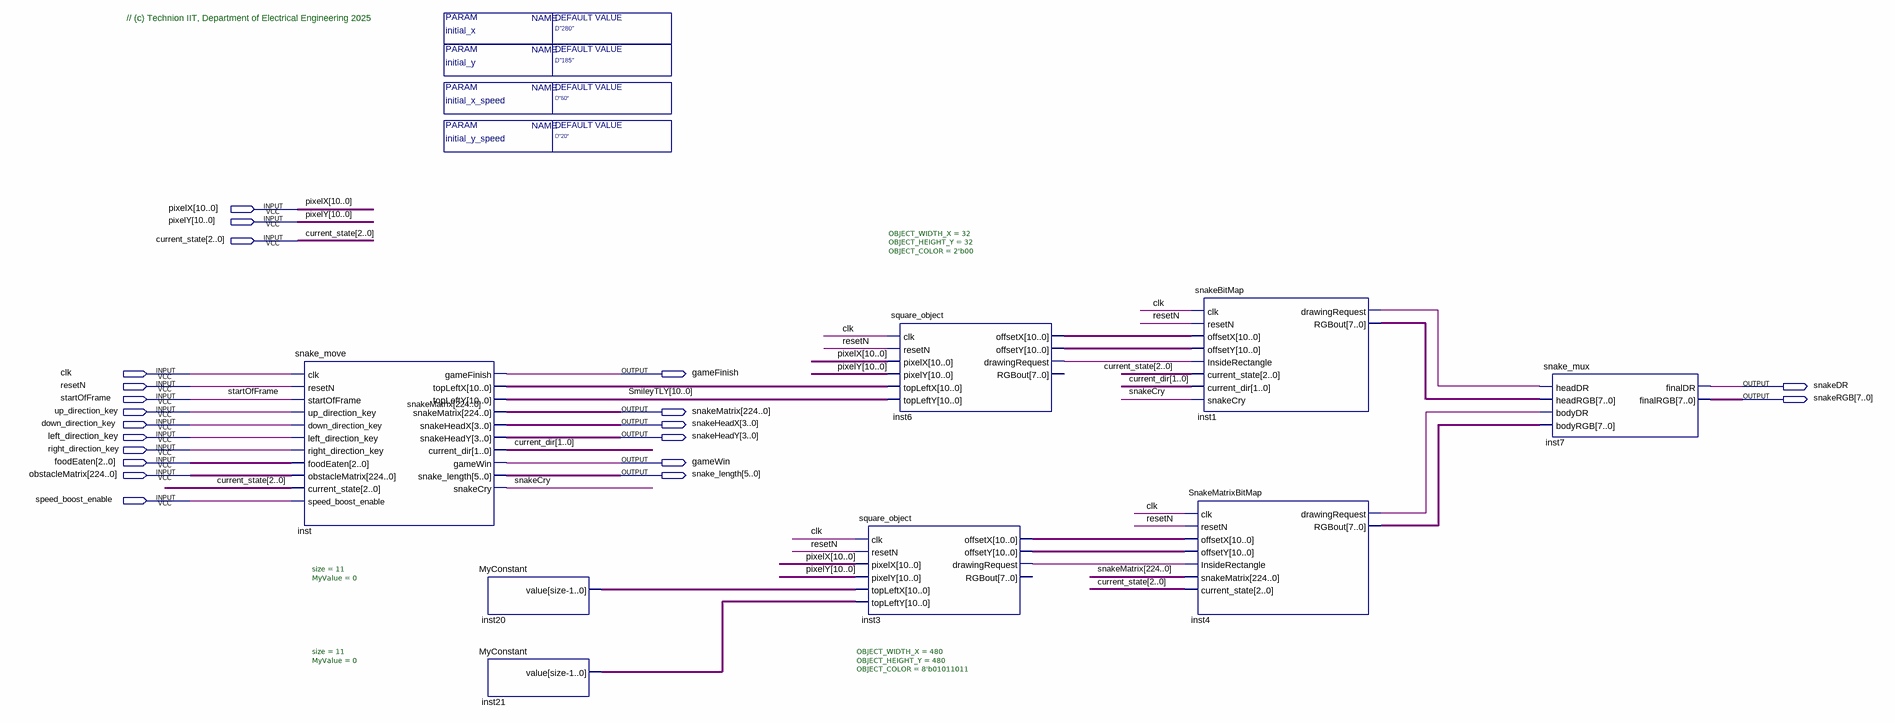
[diagram p0: schematic sheet]
// Quartus schematic Snake_Block.bdf as structural Verilog: 8 symbols, 21 pins
module Snake_Block #(parameter initial_x = "D\"280\"", parameter initial_y = "D\"185\"", parameter initial_x_speed = "D\"60\"", parameter initial_y_speed = "D\"20\"") (
  input  [10:0] pixelX,
  input  [10:0] pixelY,
  input  [2:0] current_state,
  input  clk,
  input  resetN,
  input  startOfFrame,
  input  up_direction_key,
  input  down_direction_key,
  input  left_direction_key,
  input  right_direction_key,
  input  [2:0] foodEaten,
  input  [224:0] obstacleMatrix,
  input  speed_boost_enable,
  output gameFinish,
  output snakeDR,
  output [7:0] snakeRGB,
  output [224:0] snakeMatrix,
  output [3:0] snakeHeadX,
  output [3:0] snakeHeadY,
  output gameWin,
  output [5:0] snake_length
);

  wire inst1_drawingrequest, inst3_drawingrequest, inst4_drawingrequest, inst6_drawingrequest, snakeCry;
  wire [1:0] current_dir;
  wire [7:0] inst1_rgbout, inst4_rgbout;
  wire [10:0] inst3_offsetx, inst3_offsety, inst6_offsetx, inst6_offsety, inst20_value, inst21_value,
       inst_topleftx, SmileyTLY;

  snake_move inst (
    .clk(clk), .resetN(resetN), .startOfFrame(startOfFrame), .up_direction_key(up_direction_key),
    .down_direction_key(down_direction_key), .left_direction_key(left_direction_key),
    .right_direction_key(right_direction_key), .foodEaten(foodEaten), .obstacleMatrix(obstacleMatrix),
    .current_state(current_state), .speed_boost_enable(speed_boost_enable), .gameFinish(gameFinish),
    .topLeftX(inst_topleftx), .topLeftY(SmileyTLY), .snakeMatrix(snakeMatrix), .snakeHeadX(snakeHeadX),
    .snakeHeadY(snakeHeadY), .current_dir(current_dir), .gameWin(gameWin), .snake_length(snake_length),
    .snakeCry(snakeCry));
  MyConstant #(.size(11), .MyValue(0)) inst20 (.value(inst20_value));
  MyConstant #(.size(11), .MyValue(0)) inst21 (.value(inst21_value));
  square_object #(.OBJECT_WIDTH_X(32), .OBJECT_HEIGHT_Y(32), .OBJECT_COLOR(2'b00)) inst6 (
    .clk(clk), .resetN(resetN), .pixelX(pixelX), .pixelY(pixelY), .topLeftX(inst_topleftx),
    .topLeftY(SmileyTLY), .offsetX(inst6_offsetx), .offsetY(inst6_offsety),
    .drawingRequest(inst6_drawingrequest));  // open: RGBout
  square_object #(.OBJECT_WIDTH_X(480), .OBJECT_HEIGHT_Y(480), .OBJECT_COLOR(8'b01011011)) inst3 (
    .clk(clk), .resetN(resetN), .pixelX(pixelX), .pixelY(pixelY), .topLeftX(inst20_value),
    .topLeftY(inst21_value), .offsetX(inst3_offsetx), .offsetY(inst3_offsety),
    .drawingRequest(inst3_drawingrequest));  // open: RGBout
  snakeBitMap inst1 (
    .clk(clk), .resetN(resetN), .offsetX(inst6_offsetx), .offsetY(inst6_offsety),
    .InsideRectangle(inst6_drawingrequest), .current_state(current_state), .current_dir(current_dir),
    .snakeCry(snakeCry), .drawingRequest(inst1_drawingrequest), .RGBout(inst1_rgbout));
  SnakeMatrixBitMap inst4 (
    .clk(clk), .resetN(resetN), .offsetX(inst3_offsetx), .offsetY(inst3_offsety),
    .InsideRectangle(inst3_drawingrequest), .snakeMatrix(snakeMatrix), .current_state(current_state),
    .drawingRequest(inst4_drawingrequest), .RGBout(inst4_rgbout));
  snake_mux inst7 (
    .headDR(inst1_drawingrequest), .headRGB(inst1_rgbout), .bodyDR(inst4_drawingrequest),
    .bodyRGB(inst4_rgbout), .finalDR(snakeDR), .finalRGB(snakeRGB));

  // Notes on the sheet:
  //   // (c) Technion IIT, Department of Electrical Engineering 2025
endmodule
